# Altium schematic sheet Solar Tracker 2.0 (1).SchDoc
size 431 x 279 mm; SheetNumber: 1; SheetTotal: 1; ENG_APP_DATE: --/--/--; DSN_APP_DATE: --/--/--; CHK_APP_DATE: --/--/--
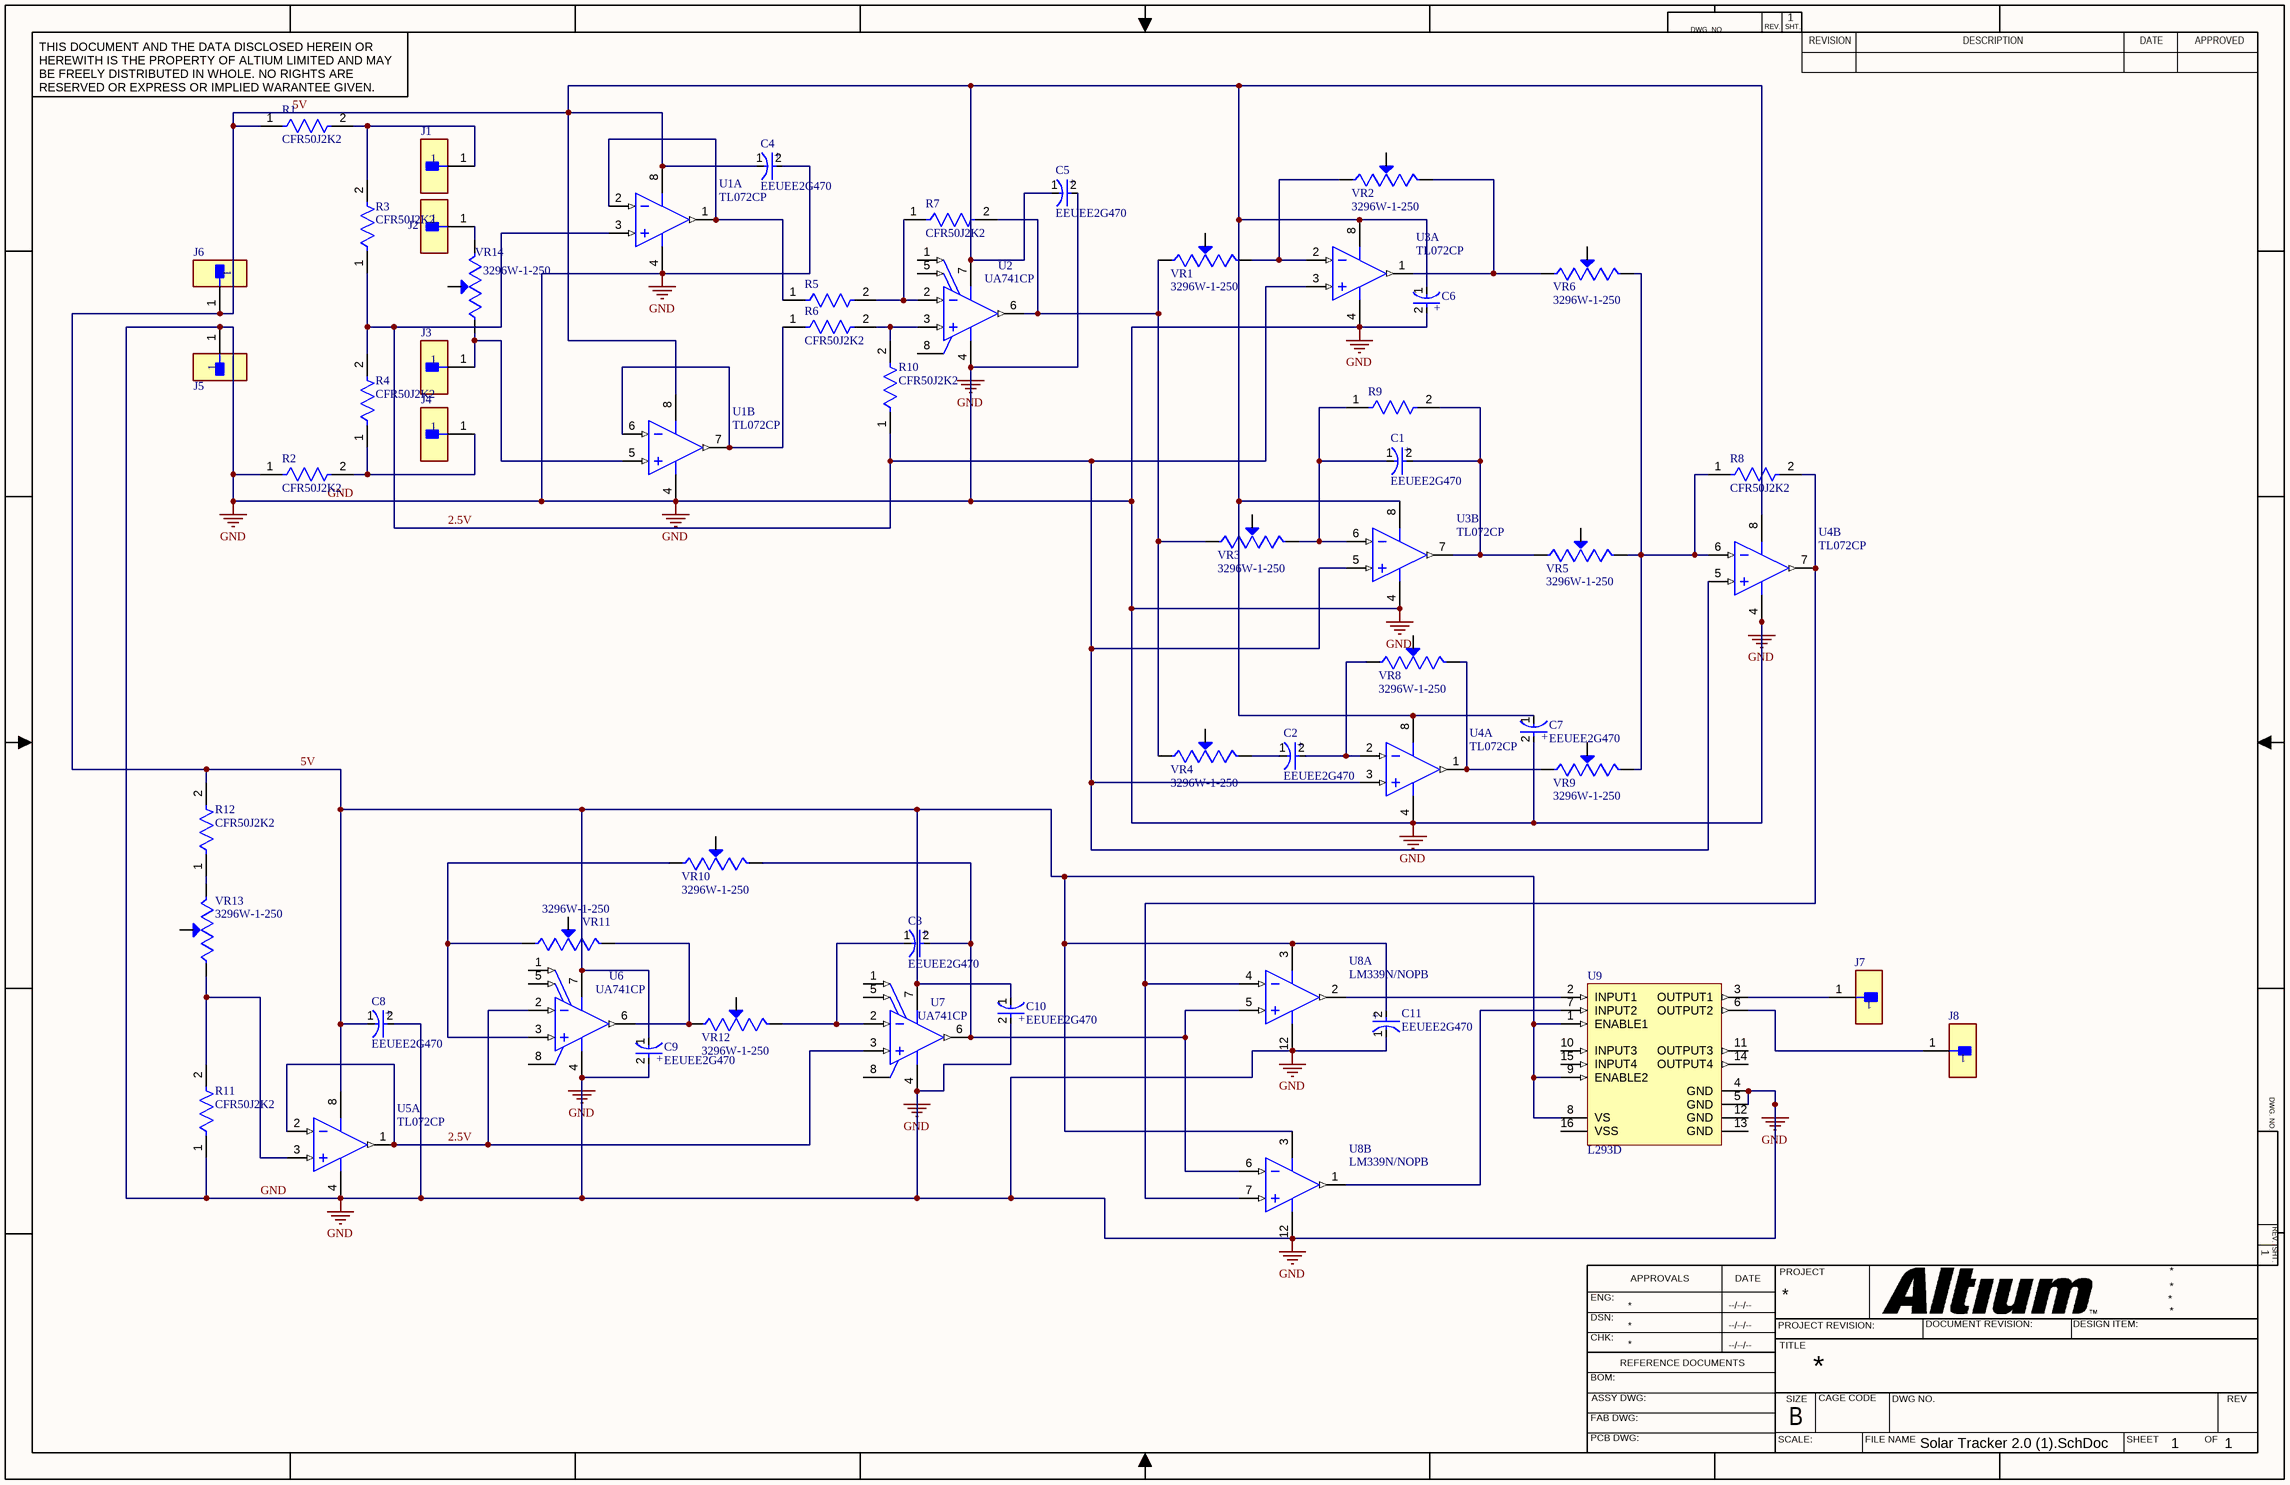
[diagram p0: Solar Tracker 2.0 (1).SchDoc]

## Parts
C1  EEUEE2G470  [FP-RAD-TH-D_16_0_5-L_25_2-MFG]
C2  EEUEE2G470  [FP-RAD-TH-D_16_0_5-L_25_2-MFG]
C3  EEUEE2G470  [FP-RAD-TH-D_16_0_5-L_25_2-MFG]
C4  EEUEE2G470  [FP-RAD-TH-D_16_0_5-L_25_2-MFG]
C5  EEUEE2G470  [FP-RAD-TH-D_16_0_5-L_25_2-MFG]
C6  EEUEE2G470  [FP-RAD-TH-D_16_0_5-L_25_2-MFG]  (value not drawn)
C7  EEUEE2G470  [FP-RAD-TH-D_16_0_5-L_25_2-MFG]
C8  EEUEE2G470  [FP-RAD-TH-D_16_0_5-L_25_2-MFG]
C9  EEUEE2G470  [FP-RAD-TH-D_16_0_5-L_25_2-MFG]
C10  EEUEE2G470  [FP-RAD-TH-D_16_0_5-L_25_2-MFG]
C11  EEUEE2G470  [FP-RAD-TH-D_16_0_5-L_25_2-MFG]
J1  PBC01SAAN  [FP-PBC01SAAN-MFG]  (value not drawn)
J2  PBC01SAAN  [FP-PBC01SAAN-MFG]  (value not drawn)
J3  PBC01SAAN  [FP-PBC01SAAN-MFG]  (value not drawn)
J4  PBC01SAAN  [FP-PBC01SAAN-MFG]  (value not drawn)
J5  PBC01SAAN  [FP-PBC01SAAN-MFG]  (value not drawn)
J6  PBC01SAAN  [FP-PBC01SAAN-MFG]  (value not drawn)
J7  PBC01SAAN  [FP-PBC01SAAN-MFG]  (value not drawn)
J8  PBC01SAAN  [FP-PBC01SAAN-MFG]  (value not drawn)
R1  CFR50J2K2  [FP-CFR50J2K2-MFG]
R2  CFR50J2K2  [FP-CFR50J2K2-MFG]
R3  CFR50J2K2  [FP-CFR50J2K2-MFG]
R4  CFR50J2K2  [FP-CFR50J2K2-MFG]
R5  CFR50J2K2  [FP-CFR50J2K2-MFG]  (value not drawn)
R6  CFR50J2K2  [FP-CFR50J2K2-MFG]
R7  CFR50J2K2  [FP-CFR50J2K2-MFG]
R8  CFR50J2K2  [FP-CFR50J2K2-MFG]
R9  CFR50J2K2  [FP-CFR50J2K2-MFG]  (value not drawn)
R10  CFR50J2K2  [FP-CFR50J2K2-MFG]
R11  CFR50J2K2  [FP-CFR50J2K2-MFG]
R12  CFR50J2K2  [FP-CFR50J2K2-MFG]
U1  TL072CP  [P0008A]  (parts A,B of 2)
U2  UA741CP  [P0008A]
U3  TL072CP  [P0008A]  (parts A,B of 2)
U4  TL072CP  [P0008A]  (parts A,B of 2)
U5  TL072CP  [P0008A]  (part A of 2)
U6  UA741CP  [P0008A]
U7  UA741CP  [P0008A]
U8  LM339N/NOPB  [NFF0014A]  (parts A,B of 4)
U9  L293D  [STM-L293D-16]
VR1  3296W-1-250  [TRIM_3296W-1-250]
VR2  3296W-1-250  [TRIM_3296W-1-250]
VR3  3296W-1-250  [TRIM_3296W-1-250]
VR4  3296W-1-250  [TRIM_3296W-1-250]
VR5  3296W-1-250  [TRIM_3296W-1-250]
VR6  3296W-1-250  [TRIM_3296W-1-250]
VR8  3296W-1-250  [TRIM_3296W-1-250]
VR9  3296W-1-250  [TRIM_3296W-1-250]
VR10  3296W-1-250  [TRIM_3296W-1-250]
VR11  3296W-1-250  [TRIM_3296W-1-250]
VR12  3296W-1-250  [TRIM_3296W-1-250]
VR13  3296W-1-250  [TRIM_3296W-1-250]
VR14  3296W-1-250  [TRIM_3296W-1-250]

## Nets
GND: C4.2(A) C5.2(A) C6.2(A) C7.2(A) C8.2(A) C9.2(A) C10.2(A) C11.1(C) J5.1 R2.1 R11.1 U1.4(VCC-) U2.4(VCC-) U3.4(VCC-) U4.4(VCC-) U5.4(VCC-) U6.4(VCC-) U7.4(VCC-) U8.12(GND) U9.4(GND) U9.5(GND)
2.5V: R3.1 R4.2 R10.1 U1.3(IN1+) U3.3(IN1+) U3.5(IN2+) U4.3(IN1+) U4.5(IN2+) U5.1(OUT1) U5.2(IN1-) U6.2(IN-) U7.3(IN+)
5V: C4.1(C) C5.1(C) C6.1(C) C7.1(C) C8.1(C) C9.1(C) C10.1(C) C11.2(A) J6.1 R1.1 R12.2 U1.8(VCC+) U2.7(VCC+) U3.8(VCC+) U4.8(VCC+) U5.8(VCC+) U6.7(VCC+) U7.7(VCC+) U8.3(V+) U9.1(ENABLE1) U9.8(VS) U9.9(ENABLE2)
NetC1_1: C1.1(C) R9.1 U3.6(IN2-) VR3.3(CW)
NetC1_2: C1.2(A) R9.2 U3.7(OUT2) VR5.1(CCW)
NetC2_1: C2.1(C) VR4.3(CW)
NetC2_2: C2.2(A) U4.2(IN1-) VR8.1(CCW)
NetC3_1: C3.1(C) U7.2(IN-) VR12.3(CW)
NetC3_2: C3.2(A) U7.6(OUT) U8.5(IN1+) U8.6(IN2-) VR10.3(CW)
NetJ1_1: J1.1 R1.2 R3.2
NetJ2_1: J2.1 VR14.3(CW)
NetJ3_1: J3.1 U1.5(IN2+) VR14.1(CCW)
NetJ4_1: J4.1 R2.2 R4.1
NetJ7_1: J7.1 U9.3(OUTPUT1)
NetJ8_1: J8.1 U9.6(OUTPUT2)
NetR5_1: R5.1 U1.1(OUT1) U1.2(IN1-)
NetR5_2: R5.2 R7.1 U2.2(IN-)
NetR6_1: R6.1 U1.6(IN2-) U1.7(OUT2)
NetR6_2: R6.2 R10.2 U2.3(IN+)
NetR7_2: R7.2 U2.6(OUT) VR1.1(CCW) VR3.1(CCW) VR4.1(CCW)
NetR8_1: R8.1 U4.6(IN2-) VR5.3(CW) VR6.3(CW) VR9.3(CW)
NetR8_2: R8.2 U4.7(OUT2) U8.4(IN1-) U8.7(IN2+)
NetR11_2: R11.2 U5.3(IN1+) VR13.1(CCW)
NetR12_1: R12.1 VR13.3(CW)
NetU3_1: U3.1(OUT1) VR2.3(CW) VR6.1(CCW)
NetU3_2: U3.2(IN1-) VR1.3(CW) VR2.1(CCW)
NetU4_1: U4.1(OUT1) VR8.3(CW) VR9.1(CCW)
NetU6_3: U6.3(IN+) VR10.1(CCW) VR11.1(CCW)
NetU6_6: U6.6(OUT) VR11.3(CW) VR12.1(CCW)
NetU8_1: U8.1(OUT2) U9.7(INPUT2)
NetU8_2: U8.2(OUT1) U9.2(INPUT1)

Not connected (* = marked no-connect by the designer): U2 1(OFFSET_N1) 5(OFFSET_N2) 8(NC); U6 1(OFFSET_N1) 5(OFFSET_N2) 8(NC); U7 1(OFFSET_N1) 5(OFFSET_N2) 8(NC); U9 10(INPUT3) 11(OUTPUT3) 12(GND) 13(GND) 14(OUTPUT4) 15(INPUT4) 16(VSS); VR1 2(WIPER); VR2 2(WIPER); VR3 2(WIPER); VR4 2(WIPER); VR5 2(WIPER); VR6 2(WIPER); VR8 2(WIPER); VR9 2(WIPER); VR10 2(WIPER); VR11 2(WIPER); VR12 2(WIPER); VR13 2(WIPER); VR14 2(WIPER)

## Notes on the sheet
- DWG. NO.
- REV.
- SHT.
- THIS DOCUMENT AND THE DATA DISCLOSED HEREIN OR HEREWITH IS THE PROPERTY OF ALTIUM LIMITED AND MAY BE FREELY DISTRIBUTED IN WHOLE. NO RIGHTS ARE RESERVED OR EXPRESS OR IMPLIED WARANTEE GIVEN.
- REVISION
- DESCRIPTION
- DATE
- APPROVED
- ENG:
- APPROVALS
- PROJECT
- DSN:
- CHK:
- REFERENCE DOCUMENTS
- PROJECT REVISION:
- TITLE
- DOCUMENT REVISION:
- DESIGN ITEM:
- BOM:
- FAB DWG:
- PCB DWG:
- ASSY DWG:
- SCALE:
- SIZE
- B
- CAGE CODE
- FILE NAME
- DWG NO.
- SHEET
- OF
- REV
- (in symbol CMP-05427-001116-1) +

## Library data of the parts
C1-C11 = CMP-05427-001116-1: Aluminum Electrolytic Capacitors (Radial Lead Type) 47uF ±20% 400V; Ripple Current (AC): 1.18A; Dissipation Factor: 0.24%; Dielectric Material: Aluminium; Life (Hours): 10000Hour; Lead Diameter: 0.8mm; Leakage Current: 1.138mA; Mount: Through Hole; Diameter: 16mm; Number of Pins: 2; Capacitance: 47uF; Package Quantity: 100; Voltage: 400V; Voltage Rating (DC): 400V; Max Operating Temperature: 105°C; Termination: Radial; Case/Package: Radial; Lead Free: Lead Free; Construction: RADIAL; Lead Pitch: 7.5mm; Series: EE; Tolerance: 20%; Length: 25mm; RoHS Compliant: Yes; Ripple Current: 1.18A; Height - Seated (Max): 0.984inch; Radiation Hardening: No; Height: 25mm; Voltage Rating: 400V; Packaging: Bulk; Min Operating Temperature: -25°C; REACH SVHC: No SVHC
J1-J8 = CMP-25680-000032-1: CONN HEADER VERT 1POS; Number of Positions: 1; Connector Type: Male Pin; Gender: Male; Pitch: 2.54mm; Contact Material: Bronze; Mount: Through Hole; Length: 2.54mm; Height: 2.54mm; Lead Free: Lead Free; Number of Rows: 1; Contact Plating: Gold; Number of Contacts: 1; Housing Material: Plastic; Termination: Solder; Package Quantity: 1; Packaging: Bulk; Color: Black; Contact Mating Length: 0.23inch; Housing Color: Black; Width: 2.54mm
R1-R12 = CMP-03212-000011-1: RES 2.2K OHM 5% 1/2W AXIAL; Temperature Coefficient: 0ppm/°C; Max Power Dissipation: 500mW; Resistance: 2.2kR; Number of Resistors: 1; Voltage Rating (DC): 350V; Case/Package: Axial; Number of Terminations: 2; REACH SVHC: No SVHC; Mount: Axial; Packaging: Cut Tape; Min Operating Temperature: -55°C; Series: CFR50, Neohm; Resistor Type: Thin Film; Tolerance: 5%; Radiation Hardening: No; Package Quantity: 3000; Power Rating: 500mW; Length: 9mm; Termination: Axial; Max Operating Temperature: 155°C; ELV: Compliant; Voltage Rating: 350V; Resistance Tolerance: 5%; Technology: CARBON FILM; Diameter: 3mm; RoHS Compliant: Yes
U1 U3-U5 = CMP-0017-00950-2: Dual Low-Noise JFET-Input General-Purpose Operational Amplifier, 7 to 36 V, 0 to 70 degC, 8-pin DIP (P8), Pb-Free (RoHS); Manufacturer: Texas Instruments; Sub Family: General Purpose Amplifier, High Supply Voltage Amplifier (>=30V); Total Supply Voltage(Max)(+5V is 5, +/-5V is 10): 36; Slew Rate(Typ)(V/us): 13; Vn at 1kHz(Typ)(nV/rtHz): 18; GBW(Typ)(MHz): 3; CMRR(Min)(dB): 70; Total Supply Voltage(Min)(+5V is 5, +/-5V is 10): 7; Vio (25C)(Max)(mV): 10; Rating: Catalog; IIB(Max)(pA): 200; Iq per channel(Max)(mA): 2.5; Number of Channels: 2; Mounting Technology: Through Hole; ComponentLink3Description: Package Specification; PartNumber: TL072CP; PackageVersion: 4040082/E, 04/2010; Eco-Plan: Pb-Free (RoHS); DatasheetVersion: SLOS080J; Offset Drift(Typ)(uV/C): 18; ComponentLink3URL: http://www.ti.com/litv/pdf/mpdi001b; PackageDescription: 8-Pin Plastic In-Line, Body 9.59 x 6.35 mm, Pitch 2.54 mm; Code_JEDEC: MS-001; ComponentLink2URL: http://www.ti.com/lit/ds/symlink/tl072.pdf; ComponentLink1Description: Manufacturer URL; ComponentLink2Description: Datasheet; ComponentLink1URL: http://www.ti.com/; PackageReference: P0008A
U2 U6 U7 = CMP-0017-00973-2: General-Purpose Operational Amplifier, 7 to 36 V, 0 to 70 degC, 8-pin DIP (P8), Pb-Free (RoHS); Manufacturer: Texas Instruments; Iq per channel(Max)(mA): 2.8; Number of Channels: 1; Total Supply Voltage(Min)(+5V is 5, +/-5V is 10): 7; IIB(Max)(pA): 800000; Slew Rate(Typ)(V/us): 0.5; Total Supply Voltage(Max)(+5V is 5, +/-5V is 10): 36; Vio (25C)(Max)(mV): 6; CMRR(Min)(dB): 70; Sub Family: General Purpose Amplifier, High Supply Voltage Amplifier (>=30V); PackageVersion: 4040082/E, 04/2010; PackageReference: P0008A; ComponentLink1URL: http://www.ti.com/; Mounting Technology: Through Hole; ComponentLink1Description: Manufacturer URL; GBW(Typ)(MHz): 1; ComponentLink2Description: Datasheet; ComponentLink2URL: http://www.ti.com/lit/ds/symlink/ua741.pdf; PartNumber: UA741CP; Code_JEDEC: MS-001; ComponentLink3Description: Package Specification; DatasheetVersion: SLOS094B; ComponentLink3URL: http://www.ti.com/litv/pdf/mpdi001b; PackageDescription: 8-Pin Plastic In-Line, Body 9.59 x 6.35 mm, Pitch 2.54 mm; Eco-Plan: Pb-Free (RoHS)
U8 = CMP-0055-00142-3: Low Power Low Offset Voltage Quad Comparator, 14-pin MDIP, Pb-Free; Manufacturer: Texas Instruments; PowerWise: N; PackageTopMarking: NSUZXYYTTE#*LM339N; CompType: Amplifiers; Code_JEDEC: MS-001-AA; PinCount: 14; ComponentLink1Description: Datasheet URL; RoHS: Y; Package Reference: NFF0014A; ComponentLink1URL: http://www.ti.com/general/docs/lit/getliterature.tsp?genericPartNumber=LM339-N&fileType=pdf; PackageDescription: MDIP, .750 x .250 x.130in, 14 Lead, .100in Pitch
U9 = CMP-2000-06524-1: Push-Pull Four Channel Driver with Diode, 4.5 to 36 V, -40 to 150 degC, 16-Pin PDIP, RoHS, Tube; Manufacturer: STMicroelectronics; Number of Outputs: 4; Current - Peak Output: 1.2A; Current - Output / Channel: 600mA; Input Type: Non-Inverting; Other Related Documents: L293DViewAllSpecifications; Dynamic Catalog: HalfBridge; Voltage - Supply: 4.5V~36V; Other Names: 497-2936-5; Package / Case: 16-DIP(0.300",7.62mm); PartNumber: L293D; Operating Temperature: -40°C~150°C; Datasheet URL: http://www.st.com/st-web-ui/static/active/en/resource/technical/document/datasheet/CD00000059.pdf; Supplier Device Package: 16-PowerDIP; Packaging: Tube; Package Description: 16-Pin Thru-Hole Dual-In-Line, Body 20 x 6.85 mm, Pitch 2.54 mm; Standard Package: 25; Datasheet Version: 07/2003; On-State Resistance: -; Manufacturer URL: http://www.st.com/; Category: IntegratedCircuits(ICs); Family: PMIC-MOSFET,BridgeDrivers-InternalSwitch; Type: HalfBridge; Series: -; Mounting Technology: ThroughHole; Package Reference: DIP-16; Mounting Type: ThroughHole
VR1-VR6 VR8-VR14 = 3296W-1-250: 25 Ohms 0.5W, 1/2W PC Pins Through Hole Trimmer Potentiometer Cermet 25.0 Turn Top Adjustment; MF: Bourns; MP: 3296W-1-250; Package: SOT-23-5 Bourns; Price: None; Availability: In Stock; SnapEDA_Link: https://www.snapeda.com/parts/3296W-1-250/Bourns/view-part/?ref=snap; Value: *; Check_prices: https://www.snapeda.com/parts/3296W-1-250/Bourns/view-part/?ref=eda